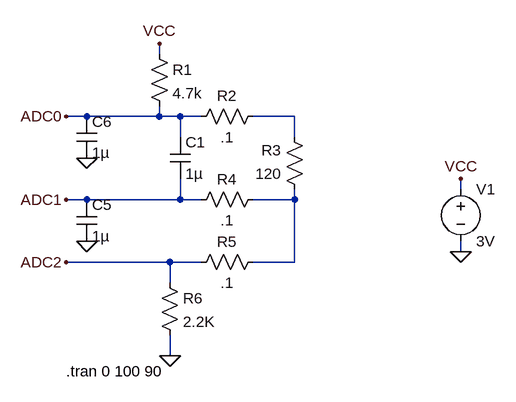
[diagram p0: schematic SimAusgangsspannung.asc]
SimAusgangsspannung.asc, the LTspice schematic file:
Version 4
SHEET 1 880 808
WIRE 192 0 192 -16
WIRE 80 96 48 96
WIRE 192 96 192 80
WIRE 192 96 80 96
WIRE 224 96 192 96
WIRE 256 96 224 96
WIRE 400 96 336 96
WIRE 224 128 224 96
WIRE 400 128 400 96
WIRE 656 208 656 192
WIRE 80 224 48 224
WIRE 224 224 224 192
WIRE 224 224 80 224
WIRE 256 224 224 224
WIRE 400 224 400 208
WIRE 400 224 336 224
WIRE 656 304 656 288
WIRE 208 320 48 320
WIRE 256 320 208 320
WIRE 400 320 400 224
WIRE 400 320 336 320
WIRE 208 352 208 320
WIRE 208 464 208 432
FLAG 208 464 0
FLAG 656 304 0
FLAG 192 -16 VCC
FLAG 656 192 VCC
FLAG 48 96 ADC0
FLAG 48 224 ADC1
FLAG 48 320 ADC2
FLAG 80 288 0
FLAG 80 160 0
DATAFLAG 128 96 ""
DATAFLAG 128 224 ""
DATAFLAG 128 320 ""
SYMBOL res 176 -16 R0
SYMATTR InstName R1
SYMATTR Value 4.7k
SYMBOL res 352 80 R90
WINDOW 0 0 56 VBottom 2
WINDOW 3 32 56 VTop 2
SYMATTR InstName R2
SYMATTR Value .1
SYMBOL res 416 224 R180
WINDOW 0 36 76 Left 2
WINDOW 3 36 40 Left 2
SYMATTR InstName R3
SYMATTR Value 120
SYMBOL res 240 240 R270
WINDOW 0 32 56 VTop 2
WINDOW 3 0 56 VBottom 2
SYMATTR InstName R4
SYMATTR Value .1
SYMBOL res 240 336 R270
WINDOW 0 32 56 VTop 2
WINDOW 3 0 56 VBottom 2
SYMATTR InstName R5
SYMATTR Value .1
SYMBOL res 192 336 R0
SYMATTR InstName R6
SYMATTR Value 2.2K
SYMBOL voltage 656 192 R0
WINDOW 123 0 0 Left 0
WINDOW 39 0 0 Left 0
SYMATTR InstName V1
SYMATTR Value 3V
SYMBOL cap 208 128 R0
SYMATTR InstName C1
SYMATTR Value 1µ
SYMBOL cap 64 224 R0
SYMATTR InstName C5
SYMATTR Value 1µ
SYMBOL cap 64 96 R0
SYMATTR InstName C6
SYMATTR Value 1µ
TEXT 48 488 Left 2 !.tran 0 100 90

The netlist it stands for:
* SimAusgangsspannung.asc
R1 VCC ADC0 4.7k
R2 N001 ADC0 .1
R3 N002 N001 120
R4 ADC1 N002 .1
R5 ADC2 N002 .1
R6 ADC2 0 2.2K
V1 VCC 0 3V
C1 ADC0 ADC1 1µ
C5 ADC1 0 1µ
C6 ADC0 0 1µ
.tran 0 100 90
.backanno
.end